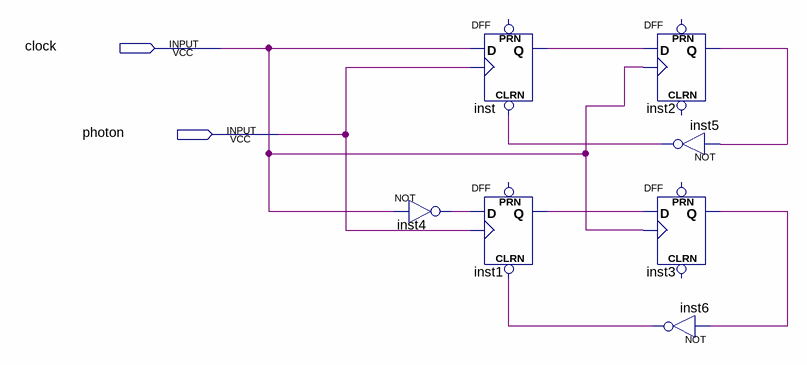
[diagram p0: schematic sheet]
// Quartus schematic edge_arrival_backup.bdf as structural Verilog: 7 symbols, 2 pins
module edge_arrival_backup (
  input  clock,
  input  photon
);

  wire inst1_q, inst2_q, inst3_q, inst4_out, inst5_out, inst6_out, inst_q;

  not inst4 (inst4_out, clock);
  DFF inst (.CLRN(inst5_out), .CLK(photon), .D(clock), .Q(inst_q));  // open: PRN
  DFF inst1 (.CLRN(inst6_out), .CLK(photon), .D(inst4_out), .Q(inst1_q));  // open: PRN
  DFF inst2 (.CLK(clock), .D(inst_q), .Q(inst2_q));  // open: CLRN, PRN
  DFF inst3 (.CLK(clock), .D(inst1_q), .Q(inst3_q));  // open: CLRN, PRN
  not inst6 (inst6_out, inst3_q);
  not inst5 (inst5_out, inst2_q);
endmodule
